# EAGLE design nrf51822 (EAGLE 7.2.0)
CNAME: BLEoT COMPACT; CREVISION: 1.0; DESIGNER: Mohammed Aljarrah
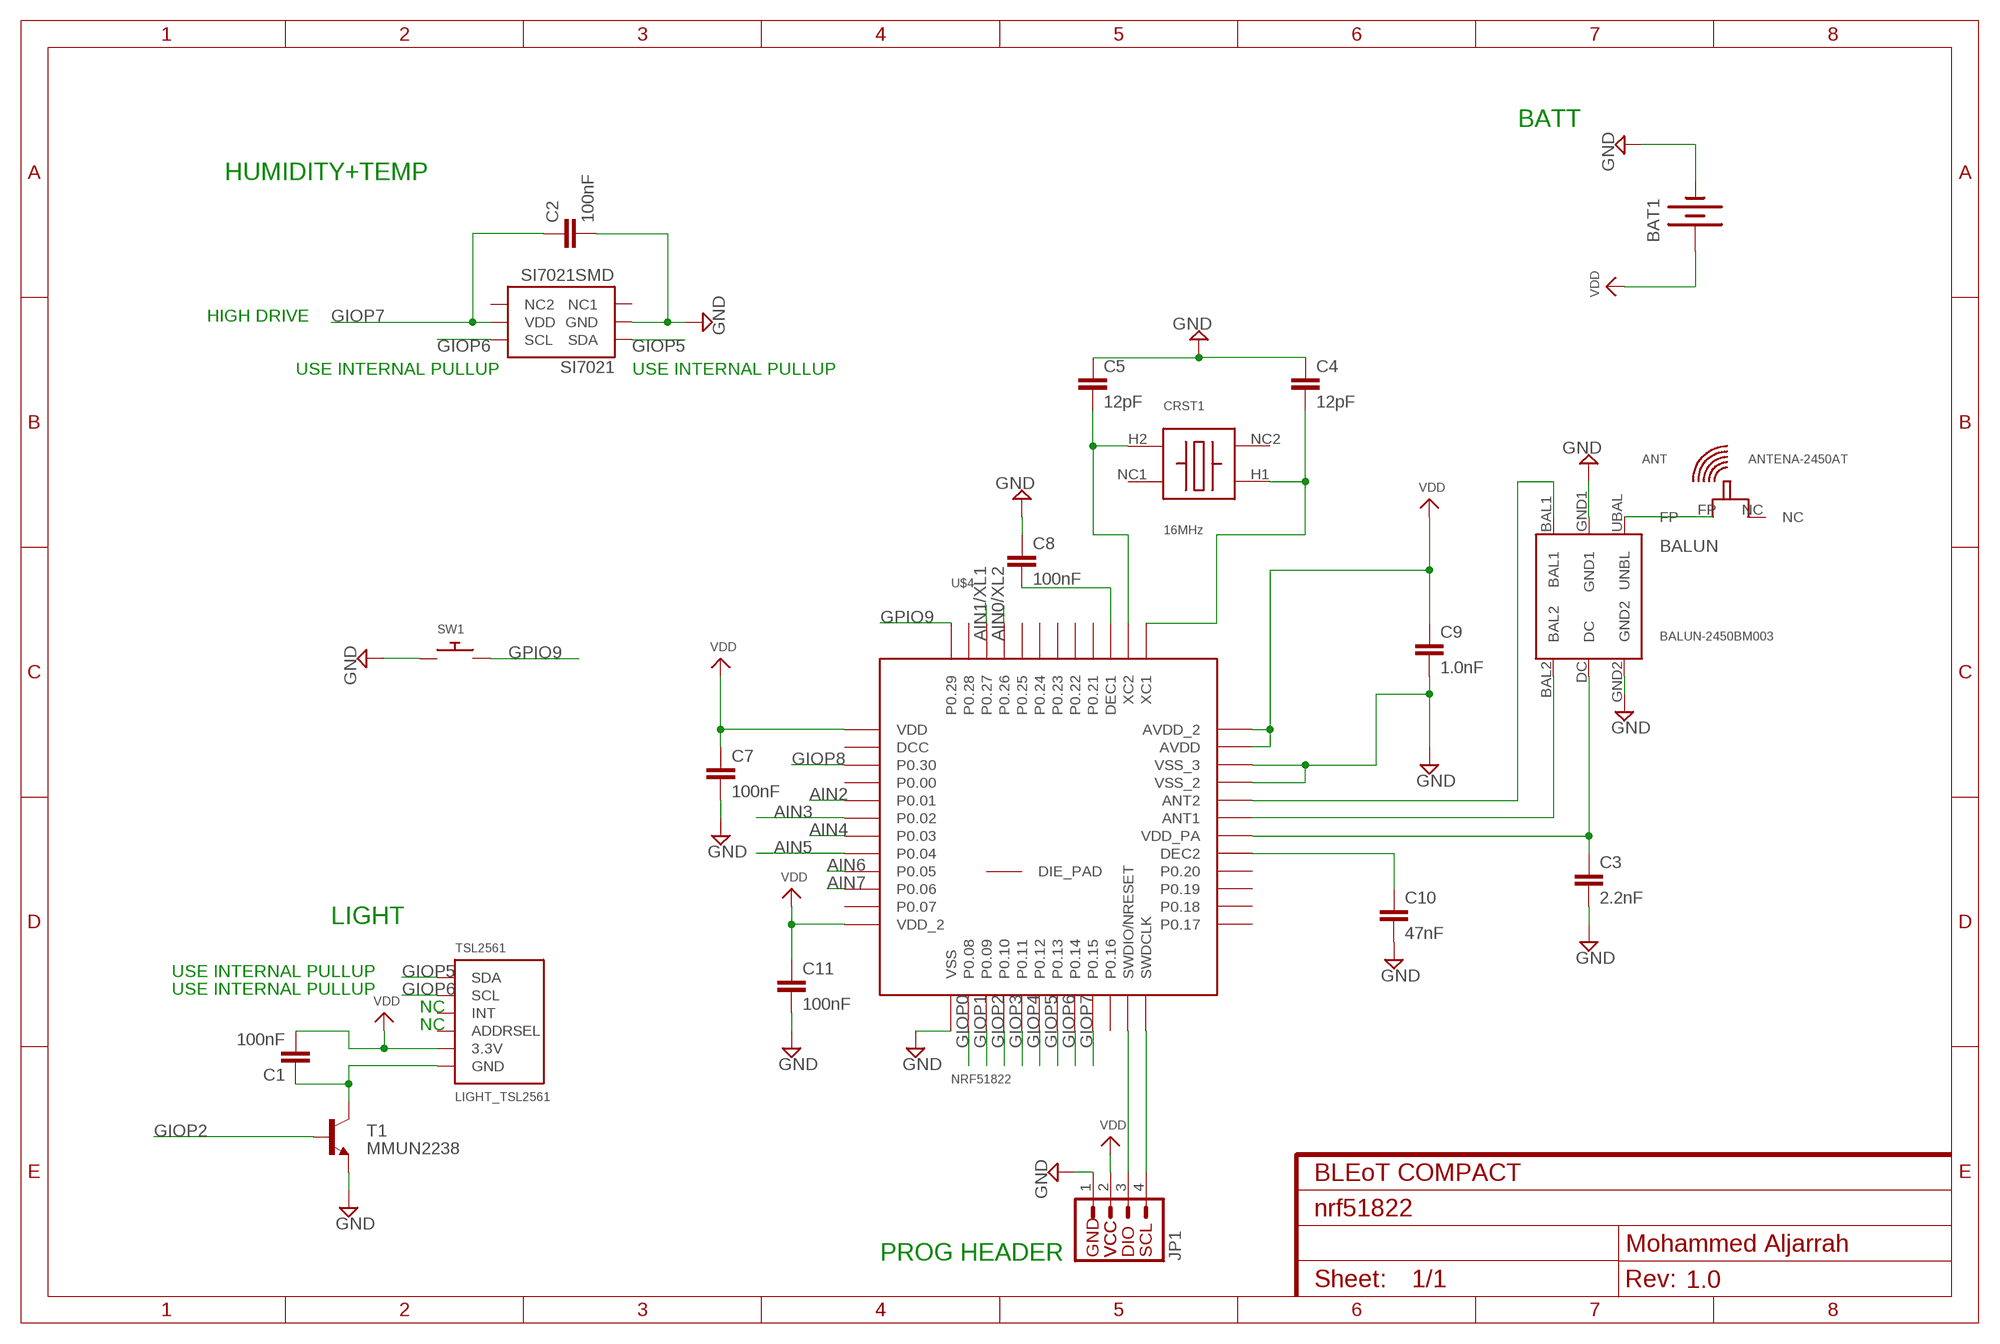
[diagram p0: schematic, sheet 1]

## Parts
ANT  ANTENA-2450AT  [2450AT18B100]
BALUN  BALUN-2450BM003  [2450BM14E0003]
BAT1  BATTERY245PTH  [BATTCON_245MM_PTH]
C1  100nF  C-EUC0805  [C0805]
C2  100nF  C-EUC0805  [C0805]
C3  2.2nF  C-EUC0805  [C0805]
C4  12pF  C-EUC0805  [C0805]
C5  12pF  C-EUC0805  [C0805]
C7  100nF  C-EUC0805  [C0805]
C8  100nF  C-EUC0805  [C0805]
C9  1.0nF  C-EUC0805  [C0805]
C10  47nF  C-EUC0805  [C0805]
C11  100nF  C-EUC0805  [C0805]
CRST1  16MHz  CX3225GB  [CRYSTAL16MHZ]
JP1  PROG_HEADER  [1X04]
SI7021  SI7021SMD  [SI7021]
SW1  SWITCH_PUSHBUTTONSOFTTOUCHSMD_SJ  [PUSHBUTTON_SMD_SJ]
T1  MMUN2238  TRANSISTOR_NPNMMBT2222A  [SOT23-3]
TSL2561  LIGHT_TSL2561  [TSL2561_FN]
U$4  NRF51822  [QFN48]

## Nets
AIN0/XL2: U$4.45(P0.26)
AIN1/XL1: U$4.46(P0.27)
AIN2: U$4.5(P0.01)
AIN3: U$4.6(P0.02)
AIN4: U$4.7(P0.03)
AIN5: U$4.8(P0.04)
AIN6: U$4.9(P0.05)
AIN7: U$4.10(P0.06)
GIOP0: U$4.14(P0.08)
GIOP1: U$4.15(P0.09)
GIOP2: T1.1(B) U$4.16(P0.10)
GIOP3: U$4.17(P0.11)
GIOP4: U$4.18(P0.12)
GIOP5: SI7021.1(SDA) TSL2561.DATA(SDA) U$4.19(P0.13)
GIOP6: SI7021.6(SCL) TSL2561.CLK(SCL) U$4.20(P0.14)
GIOP7: C2.1 SI7021.5(VDD) U$4.21(P0.15)
GIOP8: U$4.3(P0.30)
GND: BALUN.GND1 BALUN.GND2 BAT1.2(-) C2.2 C3.2 C4.1 C5.1 C7.2 C8.1 C9.2 C10.2 C11.2 JP1.1 SI7021.2(GND) SW1.P$1 T1.2(E) U$4.13(VSS) U$4.33(VSS_2) U$4.34(VSS_3)
GPIO9: SW1.P$2 U$4.48(P0.29)
N$1: C5.2 CRST1.H2 U$4.38(XC2)
N$2: C4.2 CRST1.H1 U$4.37(XC1)
N$3: ANT.FP BALUN.UBAL(UNBL)
N$4: BALUN.DC C3.1 U$4.30(VDD_PA)
N$5: C8.2 U$4.39(DEC1)
N$6: BALUN.BAL1 U$4.32(ANT2)
N$7: C1.1 T1.3(C) TSL2561.VSS(GND)
N$8: JP1.3 U$4.23(SWDIO/NRESET)
N$10: BALUN.BAL2 U$4.31(ANT1)
N$13: C10.1 U$4.29(DEC2)
N$14: JP1.4 U$4.24(SWDCLK)
VDD: BAT1.1(+) BAT1.3(+) C1.2 C7.1 C9.1 C11.1 JP1.2 TSL2561.VDD(3.3V) U$4.1(VDD) U$4.12(VDD_2) U$4.35(AVDD) U$4.36(AVDD_2)
Unconnected: ANT.NC CRST1.NC1 CRST1.NC2 SI7021.3(NC1) SI7021.4(NC2) TSL2561.ADR(ADDRSEL) TSL2561.INT U$4.2(DCC) U$4.4(P0.00) U$4.11(P0.07) U$4.22(P0.16) U$4.25(P0.17) U$4.26(P0.18) U$4.27(P0.19) U$4.28(P0.20) U$4.40(P0.21) U$4.41(P0.22) U$4.42(P0.23) U$4.43(P0.24) U$4.44(P0.25) U$4.47(P0.28) U$4.GND(DIE_PAD)

## Notes on the sheet
- BATT
- HUMIDITY+TEMP
- HIGH DRIVE
- USE INTERNAL PULLUP | USE INTERNAL PULLUP
- LIGHT
- USE INTERNAL PULLUP
- USE INTERNAL PULLUP
- NC
- NC
- PROG HEADER

## Library data of the parts
ANT = NordicSemi:ANTENA-2450AT: General Specifications: Part Number 2450AT18B100 Input Power 3W max. Frequency Range 2400 - 2500 Mhz Impedance 50 Ω Peak Gain 0.5 dBi typ. (XZ-V) Operating Temperature -40 to +85°C Average Gain -0.5 dBi typ. (XZ-V) Reel Quanity 3,000 Return Loss 9.5 dB min
BALUN = NordicSemi:BALUN-2450BM003: 2450BM14E0003 2.45GHz Impedance Matched Balun + Band Pass Filter: Optimized for Nordic's Chipset nRF51822 and nRF51422
BAT1 = SparkFun-Electromechanical:BATTERY: Battery Holders Various common sizes : AA, AAA, 18650 (PRT-12895), 20mm coin cell and 12mm coin cell. 20MM_4LEGS, BATT-10373
C1-C5 C7-C11 = rcl:C-EU: CAPACITOR, European symbol
CRST1 = NordicSemi:CX3225GB: Mouser: 581-CX3225GB16DHPQCC Manufacturer: CX3225GB16000D0HPQCC 16MHz 8pF +/-20ppm Features • Crystal unit for Consumer Products • Small and low profile 0.9mm max. (3.2×2.5×0.8mm) • Ceramic package • Reflow compatible
JP1 = NordicSemi:PROG_HEADER: SparkFun has standardized on a pinout for all I2C based sensor breakouts. This pinout allows I2C boards to be plugged directly into the headers on Arduino Uno compatible boards, and to be daisy chained easily.
SI7021 = NordicSemi:SI7021: Humidity and temp sensor Mouser Part No: 634-SI7021-A-GM Manufacturer Part No: Si7021-A10-GM
SW1 = microbuilder:SWITCH_PUSHBUTTON: Buttons SOFTTOUCHSMD_SJ - Soft touch temporary push button (Super Junk Akihabara) Compatible with SKPMANE010 [Mouser: 688-SKPMAN]
T1 = SparkFun-DiscreteSemi:TRANSISTOR_NPN: Generic NPN BJT MMBT2222A - TRANS-08049 (SOT-23, 1A 40V) MPSA42 - TRANS-09116 (SOT-23, 500mA 300V) MMBT5088LT1G - TRANS-11160 (SOT-23, 50 mA 30V) BC547 - COM-08928 <http://www.sparkfun.com/products/8928> (TO-92 45V 100mA) (1.Collector 2.Base 3.Emitter) 2N3904 - COM-00521 <http://www.sparkfun.com/products/521> (TO-92 40V 200mA) (1.Emitter 2.Base 3.Collector) P2N2222A - COM-12852 <http://www.sparkfun.com/products/12852> (TO-92 40V 600mA) (1.Collector 2.Base 3.Emitter); PROD_ID: TRANS-08049; VALUE: MMBT2222A
TSL2561 = microbuilder:LIGHT_TSL2561: TSL2561 Light-To-Digital Sensor Mouser Part Numbers: CS (obsolete): 856-TSL2561CS DFN (cheapest): 856-TSL2561FN
U$4 = NordicSemi:NRF51822: Bluetooth 4.0 Low Energy/2.4Ghz NORDIC SEMICONDUCTOR

## Net classes
0 default: width 0.203 mm, drill 0.508 mm, clearance 0.152 mm

## Board
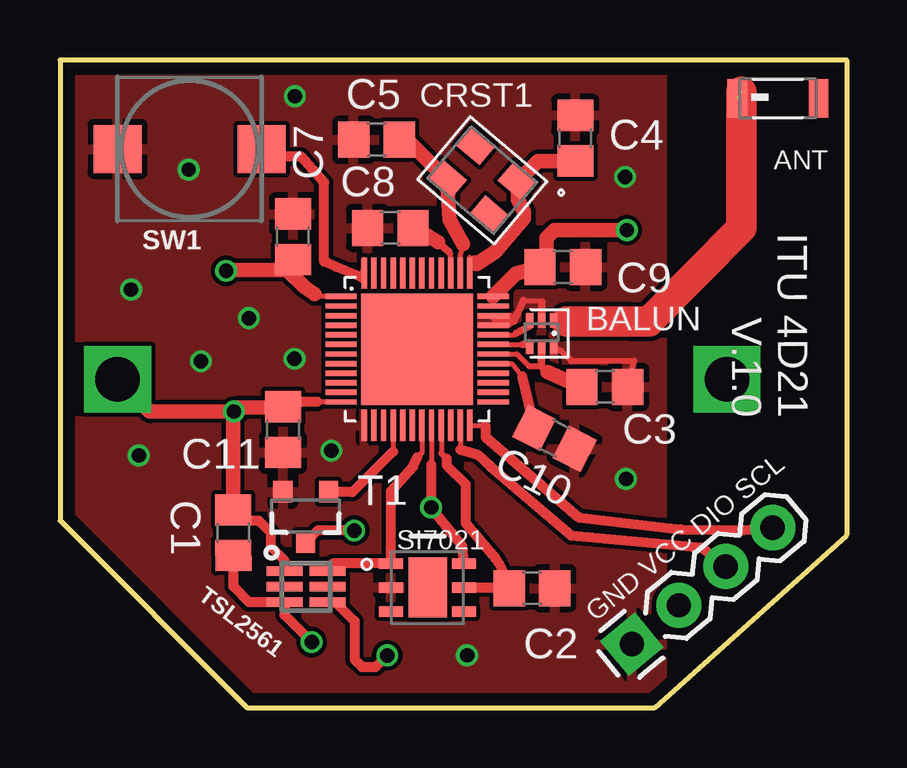
[diagram p1: board, top side]
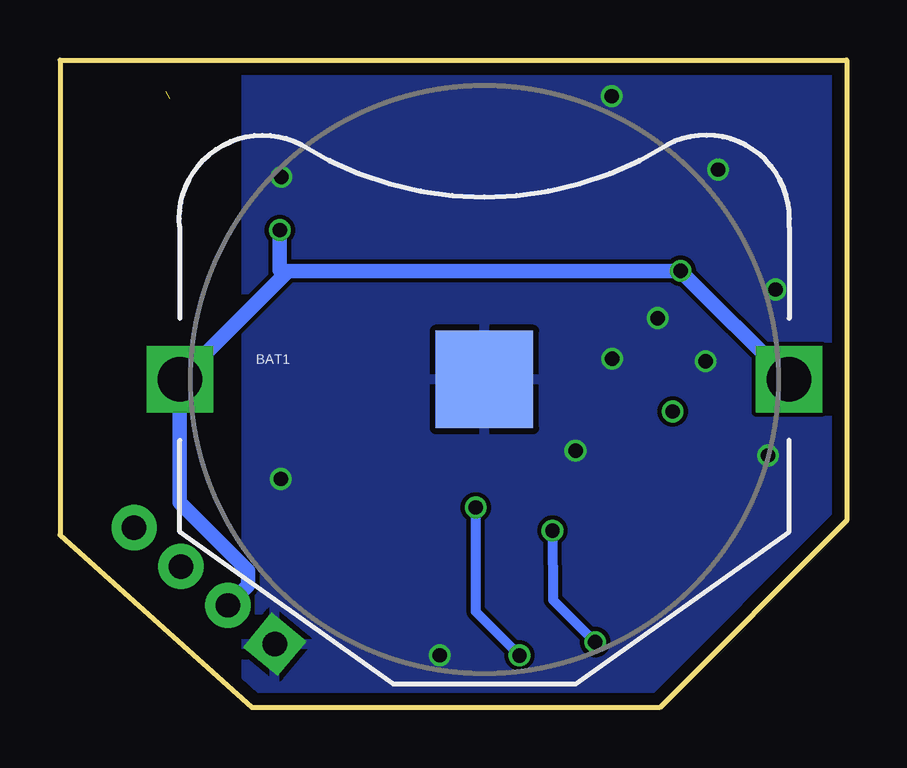
[diagram p2: board, bottom side, seen from below]

Size 32.8 x 27 mm. Coordinates in mm from the lower left corner, seen from the top.
Outline: 32.8,7.18 24.8,0 7.8,0 0,7.8 0,27 32.8,27 32.8,7.2
Copper layers (1*16): Top 0.035mm / dielectric 1.5mm / Bottom 0.035mm
Design rules "4D21": minimum track width 8mil, minimum drill 12mil, track to track 7mil, track to pad 6mil, pad to pad 6mil, via to via 7mil, smd to smd 0mil, copper to edge 20mil, drill to drill 10mil, minimum pad ring 10mil, minimum via ring 6mil, stop-mask expansion 2mil, vias tented up to drill 25mil, thermal gap 10mil

### Footprints (pad centres in the part's own frame; a part is rotated, then mirrored left to right if it is on the bottom)
2450AT18B100 = smd 0.8 x 1.6: FP -1.7,0; NC 1.7,0
2450BM14E0003 = smd 0.3 x 0.6: BAL1 0,0.05; BAL2 0,-1.05; DC 0.5,-1.05; GND1 0.5,0.05; GND2 1,-1.05; UBAL 1,0.05
BATTCON_245MM_PTH = drill 1.854 square: 1 -12.7,0; 3 12.7,0 | smd 4.064 x 4.064: 2 0,0
C0805 = smd 1.3 x 1.5: 1 -0.95,0; 2 0.95,0
CRYSTAL16MHZ = smd 1.3 x 1.05: H1 -1.15,-0.925; H2 1.15,0.925; NC1 -1.15,0.925; NC2 1.15,-0.925
1X04 = drill 1.016 pad 1.88 square: 1 0,0 | drill 1.016 pad 1.88: 2 2.54,0; 3 5.08,0; 4 7.62,0
SI7021 = smd 1 x 0.45: 1 1.525,-1; 2 1.525,0; 3 1.525,1; 4 -1.525,1; 5 -1.525,0; 6 -1.525,-1 | smd 1.6 x 2.5: 7 0,0
PUSHBUTTON_SMD_SJ = smd 2 x 2: P$1 3,0; P$2 -3,0
SOT23-3 = smd 0.8 x 0.9: 1 -0.95,-1; 2 0.95,-1; 3 0,1.1
TSL2561_FN = smd 1.5 x 0.4: ADR -0.9,0; CLK 0.9,-0.65; DATA 0.9,0.65; INT 0.9,0; VDD -0.9,0.65; VSS -0.9,-0.65
QFN48 = smd 1.3 x 0.226: 1 -3.17,2.2; 2 -3.17,1.8; 3 -3.17,1.4; 4 -3.17,1; 5 -3.17,0.6; 6 -3.17,0.2; 7 -3.17,-0.2; 8 -3.17,-0.6; 9 -3.17,-1; 10 -3.17,-1.4; 11 -3.17,-1.8; 12 -3.17,-2.2; 25 3.17,-2.2; 26 3.17,-1.8; 27 3.17,-1.4; 28 3.17,-1; 29 3.17,-0.6; 30 3.17,-0.2; 31 3.17,0.2; 32 3.17,0.6; 33 3.17,1; 34 3.17,1.4; 35 3.17,1.8; 36 3.17,2.2 | smd 0.226 x 1.3: 13 -2.2,-3.17; 14 -1.8,-3.17; 15 -1.4,-3.17; 16 -1,-3.17; 17 -0.6,-3.17; 18 -0.2,-3.17; 19 0.2,-3.17; 20 0.6,-3.17; 21 1,-3.17; 22 1.4,-3.17; 23 1.8,-3.17; 24 2.2,-3.17; 37 2.2,3.17; 38 1.8,3.17; 39 1.4,3.17; 40 1,3.17; 41 0.6,3.17; 42 0.2,3.17; 43 -0.2,3.17; 44 -0.6,3.17; 45 -1,3.17; 46 -1.4,3.17; 47 -1.8,3.17; 48 -2.2,3.17 | smd 4.66 x 4.66: GND 0,0

### Placement (x,y rotation side)
ANT  29.93,25.4 0 top
BALUN  19.58,16.1 0 top
BAT1  15.1,13.68 0 bottom
C1  7.23,7.28 90.3 top
C2  19.68,4.98 0 top
C3  22.72,13.37 0 top
C4  21.48,23.74 270 top
C5  13.2,23.68 0 top
C7  9.71,19.63 90 top
C8  13.77,20 0 top
C9  20.97,18.37 0 top
C10  20.61,11.22 333 top
C11  9.3,11.59 270 top
CRST1  17.61,21.98 139.8 top
JP1  23.84,2.64 39.6 top
SI7021  15.33,5 180 top
SW1  5.4,23.29 180 top
T1  10.24,7.99 180 top
TSL2561  10.26,5.04 0 top
U$4  14.89,14.94 0 top

### Tracks (layer width: path | path; a pad name or v marks a point on that pad's centre or on a via)
GIOP2
  Top 0.203: U$4.16 13.89,10.68 | 11.2,8.98 T1.1
  Top 0.406: 13.89,10.68 12.19,8.98 11.2,8.98
GIOP5
  Top 0.203: U$4.19 15.09,10.63 14.9,10.44
  Top 0.406: TSL2561.DATA 11.37,6 SI7021.1 13.8,9.03 14.72,10.05 14.9,10.44
GIOP6  (via drill 0.6)
  Top 0.203: U$4.20 15.49,10.14 15.47,10.12
  Top 0.406: 15.47,10.12 v15.47,8.35 16.78,6.74 SI7021.6 | TSL2561.CLK 11.49,4.39 12.29,3.6 12.29,2 12.59,1.69 13.16,1.69 v13.64,2.17
  Bottom 0.406: v15.47,8.35 15.47,4 v13.64,2.17
GIOP7
  Top 0.203: U$4.21 15.9,11.76 15.9,10.6
  Top 0.254: 15.9,10.6 16.12,10.38
  Top 0.406: 18.62,4.99 18.61,5 SI7021.5 18.7,5 C2.1 18.79,5.04 18.28,6.04 18.15,6.21 17.06,7.51 16.91,7.69 16.91,9.31 16.12,10.1 16.12,10.38
GND  (via drill 0.6)
  Top 0.203: 18.75,16.24 18.07,16.29 | 19.32,16.96 20.09,16.96 20.09,16.91 | 20.09,15.98 BALUN.GND1 | 18.15,16.07 U$4.34 | C9.2 21.84,18.28 21.79,18.25
  Top 0.254: BALUN.GND2 20.89,14.87 21.32,14.44 23.93,14.46 C3.2 | 18.48,16.05 18.15,16.07
  Top 0.305: 18.07,16.29 18.92,16.11 19.32,16.96 | 20.09,16.91 20.09,15.98
  Top 0.406: 18.75,16.24 18.68,16.07 18.48,16.05
  other vias: 2.97,17.43 3.29,10.51 16.97,2.18 9.8,25.49 11.31,10.71 23.6,9.53 5.88,14.44 23.57,22.13 9.78,14.54 7.88,16.24 5.37,22.43
  pour Top: -2.8,28.01 25.09,28.01 25.09,-1.18 -2.8,-1.18
  pour Bottom: -2.78,28.52 25.05,28.24 25.05,-1.05 -2.75,-1.15 -2.75,28.16
GPIO9
  Top 0.203: U$4.48 12.66,18.68 12.59,17.92
  Top 0.406: 12.59,17.92 11.5,18.38 11.02,18.59 11.02,21.89 10.05,22.98 8.11,22.98 SW1.P$2
N$1
  Top 0.203: 16.81,19.32 16.73,19.07 16.68,18.86 U$4.38
  Top 0.61: C5.2 14.47,23.68 CRST1.H2 16.23,20.35 16.81,19.32
N$2
  Top 0.203: U$4.37 17.09,18.77 17.29,18.56
  Top 0.61: C4.2 19.93,22.79 CRST1.H1 19.08,21.18 19.35,20.67 19.35,20.41 18.13,18.99 17.37,18.48 17.29,18.56
N$3  (1 unrouted)
  Top 0.305: 21.18,16.1 20.58,16.02 BALUN.UBAL
  Top 1.27: 21.12,16.1 21.18,16.1 23.73,16.1 24.35,16.08 24.55,16.08 28.4,20 28.4,25.67
N$4
  Top 0.203: U$4.30 19.05,14.74 19.55,14.24 | 20.07,14.24 20.08,14.23
  Top 0.254: 20.32,13.98 20.35,14.06 | 19.55,14.24 20.07,14.24
  Top 0.305: BALUN.DC 20.08,14.23 20.32,13.98
  Top 0.406: C3.1 21.21,13.6
  Top 0.61: 21.21,13.6 20.32,13.98
N$5
  Top 0.203: U$4.39 16.29,18.92 16.21,19
  Top 0.305: 16.21,19 15.75,19.4 | 14.77,19.88 C8.2
  Top 0.61: 15.75,19.4 15.32,19.68 14.77,19.88
N$6
  Top 0.203: U$4.32 18.97,15.54 19.04,15.61
  Top 0.305: BALUN.BAL1 19.58,15.9 19.04,15.61
N$7  (via drill 0.6)
  Top 0.406: 9.45,4.38 TSL2561.VSS | v12.27,7.38 10.73,7.38 T1.3 | TSL2561.VSS 7.89,4.39 7.23,5.05 C1.1 | TSL2561.VSS 9.36,3.86 v10.49,2.73
  Bottom 0.406: v12.27,7.38 12.25,4.48 v10.49,2.73
N$8
  Top 0.203: U$4.23 16.69,10.76
  Top 0.406: 16.69,10.76 17.41,10.55 17.96,10.02 21.31,7.17 26.75,6.67 JP1.3
N$10
  Top 0.203: U$4.31 19.31,15.14
  Top 0.305: BALUN.BAL2 19.55,15.22 19.31,15.14
N$13
  Top 0.203: U$4.29 18.84,14.34 19.27,13.81 | 19.78,11.64 C10.1
  Top 0.406: 19.27,13.81 19.78,11.64
N$14
  Top 0.203: 17.71,11.75 17.11,11.75 U$4.24
  Top 0.406: 17.71,11.75 17.76,11.7 17.76,11.27 21.62,7.93 25.87,7.43 27.24,7.4 28.54,7.4 JP1.4
VDD  (via drill 0.6)
  Top 0.203: U$4.12 10.72,12.74 | U$4.1 10.51,17.14 10.62,17.24 | U$4.35 U$4.36
  Top 0.254: 20.28,17.92 C9.1
  Top 0.406: C7.1 9.59,18.25 | 10.72,12.74 9.5,12.74 C11.1 | TSL2561.VDD 9.36,6.14 8.8,6.7 8.8,7.28 8.3,7.79 7.67,7.79 C1.2
  Top 0.61: C11.1 9.27,12.51 7.42,12.51 v7.25,12.34 | 9.59,18.25 9.48,18.25 | 10.62,17.24 10.19,17.54 9.48,18.25 | C9.1 19.01,18.09 U$4.36 | 20.28,17.92 20.28,19.57 20.62,19.91 v23.63,19.91 | C1.2 7.22,12.31 v7.25,12.34 | v7.25,12.34 3.74,12.34 BAT1.3 | 9.48,18.25 6.97,18.25 v6.92,18.2
  Bottom 0.61: 25.5,4.83 25.5,4.56 JP1.2 24.96,5.1 24.96,5.71 27.8,8.55 BAT1.1 23.44,18.04 | BAT1.3 v6.92,18.2 23.28,18.2 23.44,18.04 | v23.63,19.91 23.63,18.23 23.44,18.04

### Text on the board
tPlace: ITU 4D21 / V.1.0 | GND VCC DIO SCL